# EAGLE design M3-LogicModule (EAGLE 7.6.0)
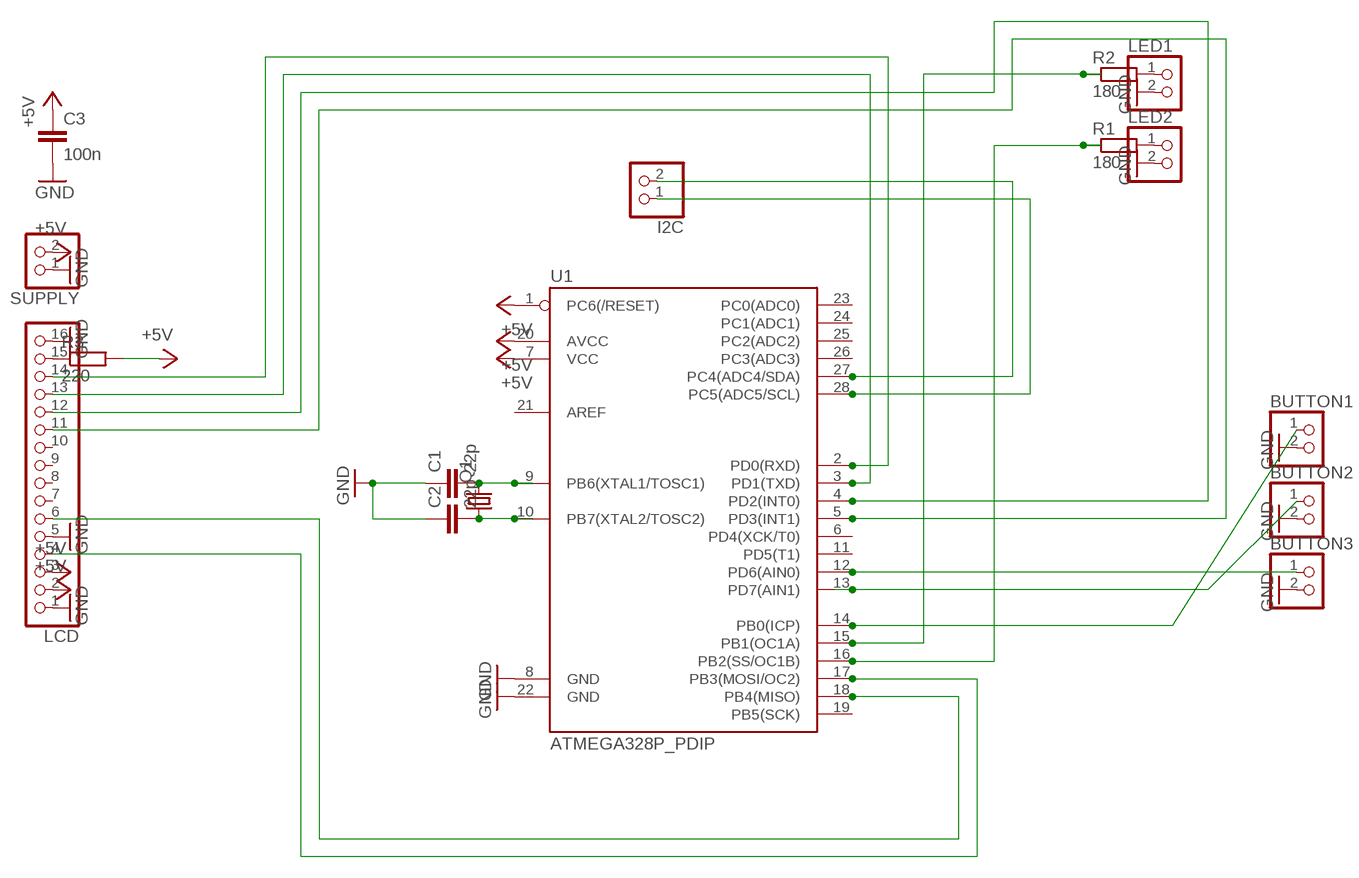
[diagram p0: schematic, sheet 1]

## Parts
BUTTON1  PINHD-1X2  [1X02]
BUTTON2  PINHD-1X2  [1X02]
BUTTON3  PINHD-1X2  [1X02]
C1  22p  C-EU025-025X050  [C025-025X050]
C2  22p  C-EU025-025X050  [C025-025X050]
C3  100n  C2,5-3  [C2.5-3]
I2C  PINHD-1X2  [1X02]
LCD  PINHD-1X16  [1X16]
LED1  PINHD-1X2  [1X02]
LED2  PINHD-1X2  [1X02]
Q1  CRYSTALHC49S  [HC49/S]
R1  180  R-EU_0309/12  [0309/12]
R2  180  R-EU_0309/12  [0309/12]
R3  220  R-EU_0309/10  [0309/10]
SUPPLY  PINHD-1X2  [1X02]
U1  ATMEGA328P_PDIP  [DIL28-3]

## Nets
+5V: C3.1 LCD.2 LCD.3 R3.2 SUPPLY.2 U1.1(PC6(/RESET)) U1.7(VCC) U1.20(AVCC)
GND: BUTTON1.2 BUTTON2.2 BUTTON3.2 C1.1 C2.1 C3.2 LCD.1 LCD.5 LCD.16 LED1.2 LED2.2 SUPPLY.1 U1.8(GND) U1.22(GND)
N$1: C1.2 Q1.2 U1.9(PB6(XTAL1/TOSC1))
N$2: LED2.1 R1.2
N$3: LED1.1 R2.2
N$4: R2.1 U1.15(PB1(OC1A))
N$5: R1.1 U1.16(PB2(SS/OC1B))
N$6: BUTTON1.1 U1.14(PB0(ICP))
N$7: BUTTON2.1 U1.13(PD7(AIN1))
N$8: BUTTON3.1 U1.12(PD6(AIN0))
N$9: C2.2 Q1.1 U1.10(PB7(XTAL2/TOSC2))
N$10: LCD.15 R3.1
N$11: LCD.14 U1.2(PD0(RXD))
N$12: LCD.13 U1.3(PD1(TXD))
N$13: LCD.12 U1.4(PD2(INT0))
N$14: LCD.11 U1.5(PD3(INT1))
N$15: LCD.4 U1.17(PB3(MOSI/OC2))
N$16: LCD.6 U1.18(PB4(MISO))
N$17: I2C.1 U1.28(PC5(ADC5/SCL))
N$18: I2C.2 U1.27(PC4(ADC4/SDA))
Unconnected: LCD.7 LCD.8 LCD.9 LCD.10 U1.6(PD4(XCK/T0)) U1.11(PD5(T1)) U1.19(PB5(SCK)) U1.21(AREF) U1.23(PC0(ADC0)) U1.24(PC1(ADC1)) U1.25(PC2(ADC2)) U1.26(PC3(ADC3))

## Library data of the parts
BUTTON1-BUTTON3 I2C LED1 LED2 SUPPLY = pinhead:PINHD-1X2: PIN HEADER
C1 C2 = rcl:C-EU: CAPACITOR, European symbol
C3 = capacitor-wima:C: CAPACITOR naming: grid - package width
LCD = pinhead:PINHD-1X16: PIN HEADER
Q1 = crystal:CRYSTAL: CRYSTAL; OC_FARNELL: 1667008; OC_NEWARK: unknown
R1 R2 = resistor:R-EU_: RESISTOR, European symbol
R3 = rcl:R-EU_: RESISTOR, European symbol
U1 = SparkFun-DigitalIC:ATMEGA328P_PDIP: uC used in the Arduino 32kb flash, 1k EEPROM, 2k SRAM This is the through-hole version of this chip.

## Board
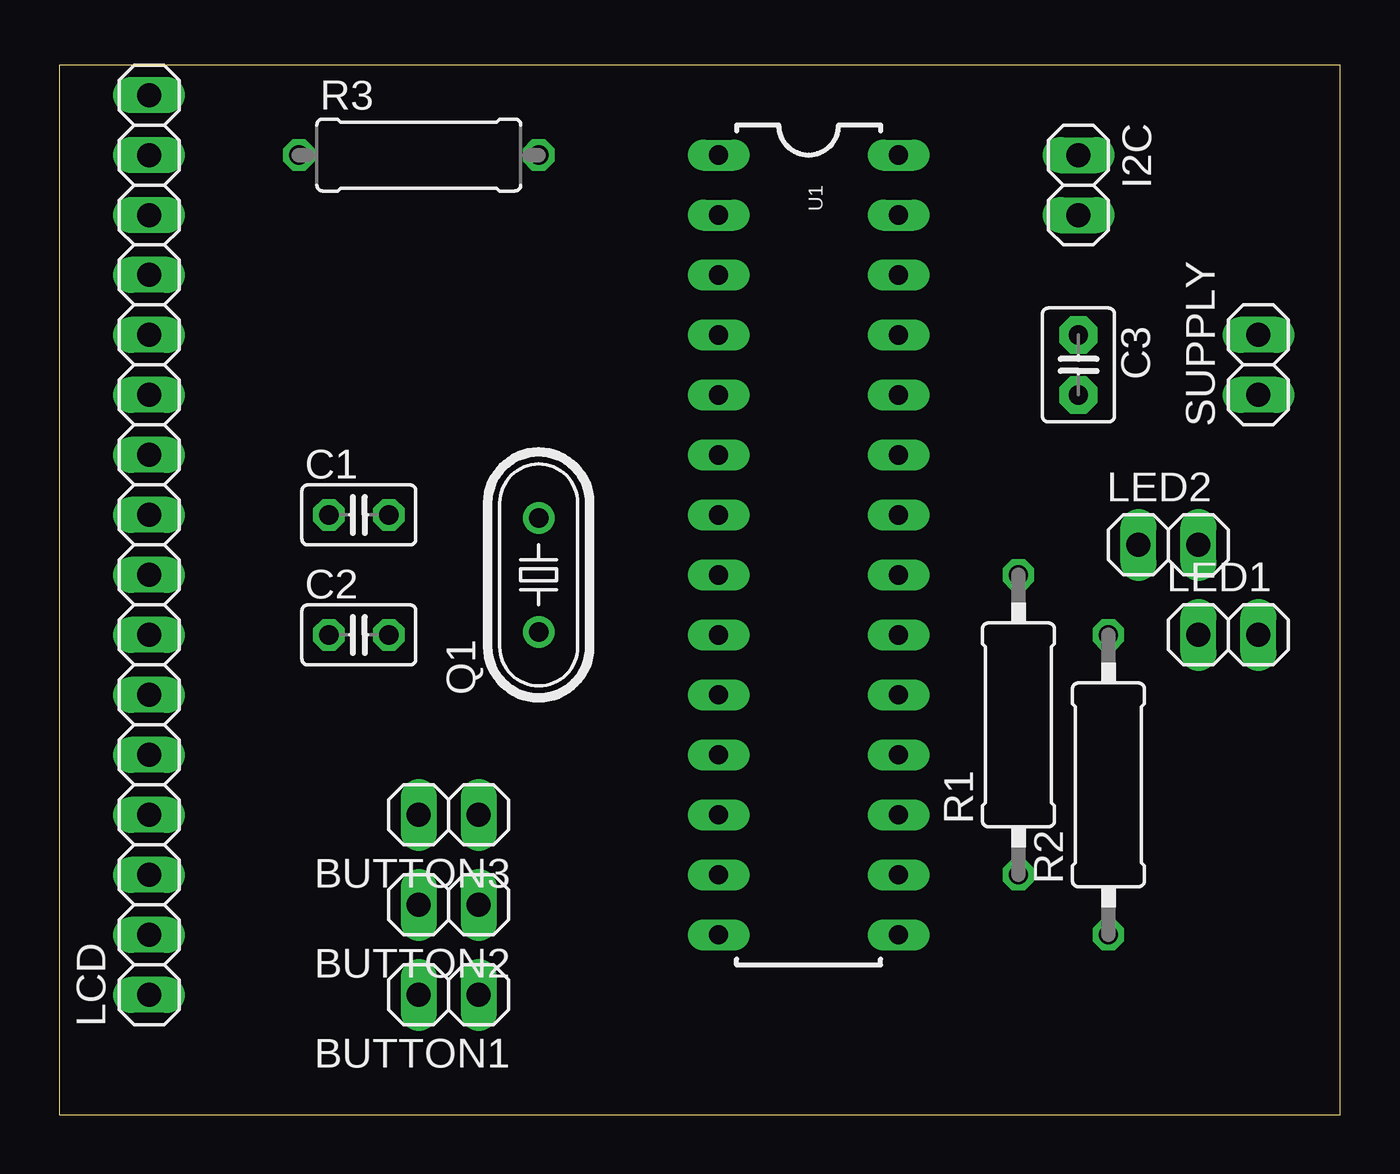
[diagram p1: board, top side]
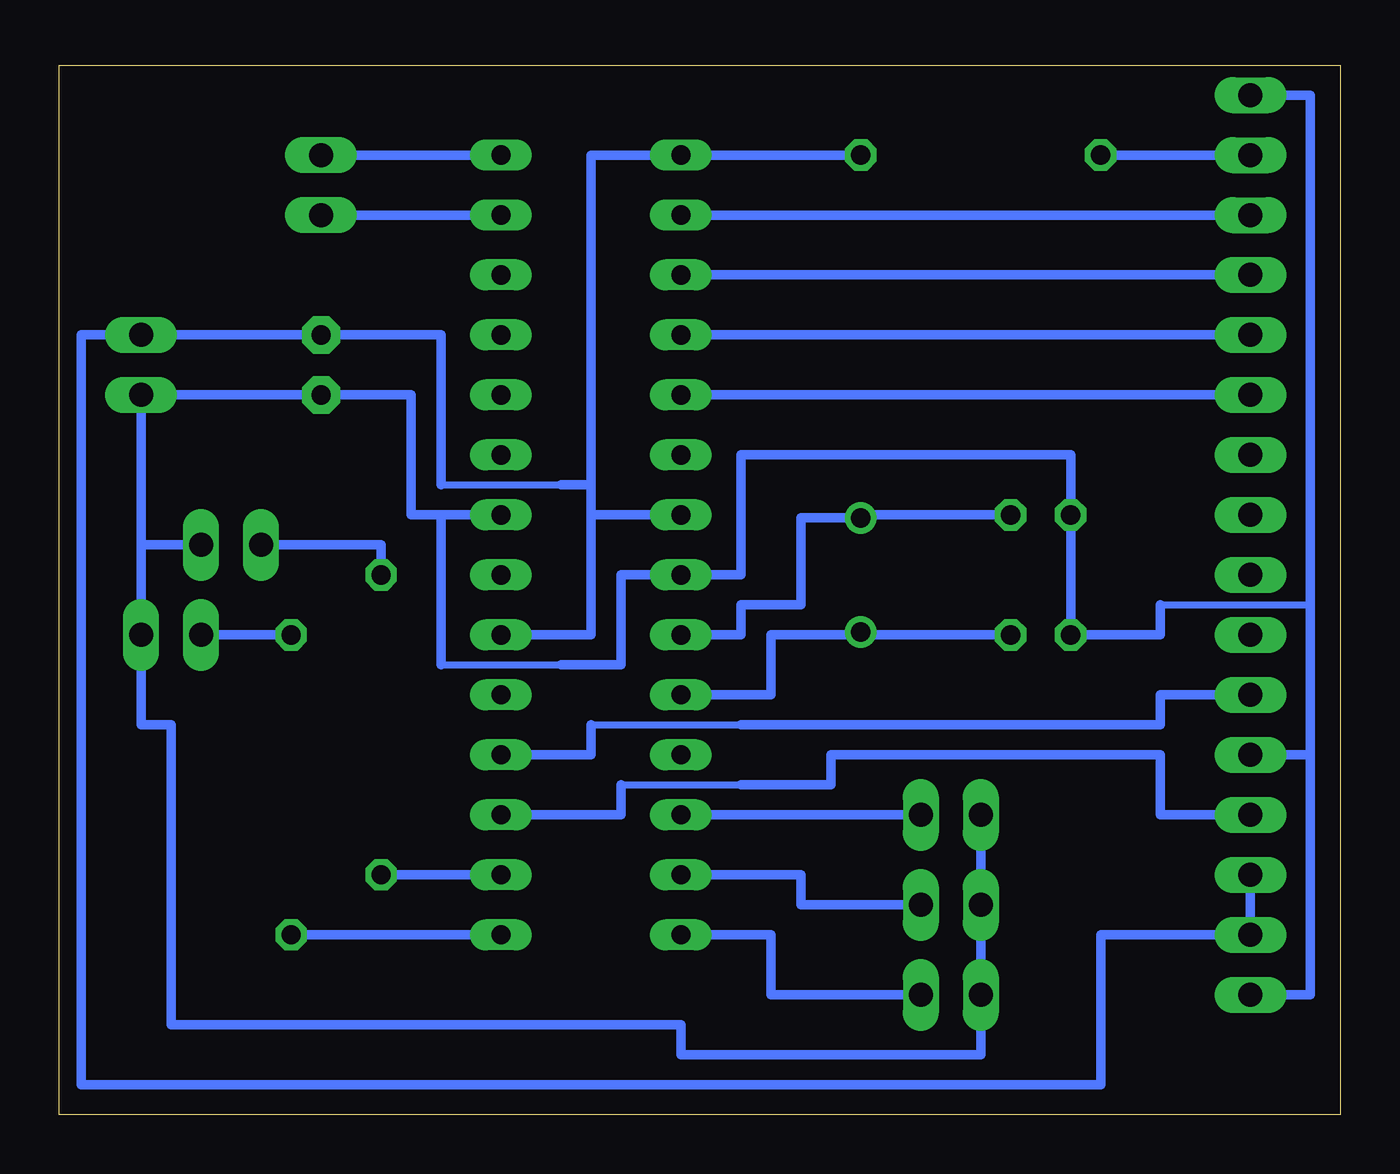
[diagram p2: board, bottom side, seen from below]

Size 54.28 x 44.44 mm. Coordinates in mm from the lower left corner, seen from the top.
Outline: 0,0 54.28,0 54.28,44.44 0,44.44 0,0
Copper layers (1*16): Top 0.035mm / dielectric 1.5mm / Bottom 0.035mm
Design rules "default": minimum track width 10mil, minimum drill 24mil, track to track 8mil, track to pad 8mil, pad to pad 8mil, via to via 8mil, smd to smd 8mil, copper to edge 40mil, drill to drill 8mil, minimum pad ring 10mil, minimum via ring 8mil, stop-mask expansion 4mil, vias tented up to drill 0mil, thermal gap 10mil

### Footprints (pad centres in the part's own frame; a part is rotated, then mirrored left to right if it is on the bottom)
1X02 = drill 1.016 long: 1 -1.27,0; 2 1.27,0
C025-025X050 = drill 0.813 octagon: 1 -1.27,0; 2 1.27,0
C2.5-3 = drill 0.813 pad 1.6 octagon: 1 -1.27,0; 2 1.27,0
1X16 = drill 1.016 long: 1 -19.05,0; 2 -16.51,0; 3 -13.97,0; 4 -11.43,0; 5 -8.89,0; 6 -6.35,0; 7 -3.81,0; 8 -1.27,0; 9 1.27,0; 10 3.81,0; 11 6.35,0; 12 8.89,0; 13 11.43,0; 14 13.97,0; 15 16.51,0; 16 19.05,0
HC49/S = drill 0.813: 1 -2.413,0; 2 2.413,0
0309/12 = drill 0.813 octagon: 1 -6.35,0; 2 6.35,0
0309/10 = drill 0.813 octagon: 1 -5.08,0; 2 5.08,0
DIL28-3 = drill 0.813 long: 1 -16.51,-3.81; 2 -13.97,-3.81; 3 -11.43,-3.81; 4 -8.89,-3.81; 5 -6.35,-3.81; 6 -3.81,-3.81; 7 -1.27,-3.81; 8 1.27,-3.81; 9 3.81,-3.81; 10 6.35,-3.81; 11 8.89,-3.81; 12 11.43,-3.81; 13 13.97,-3.81; 14 16.51,-3.81; 15 16.51,3.81; 16 13.97,3.81; 17 11.43,3.81; 18 8.89,3.81; 19 6.35,3.81; 20 3.81,3.81; 21 1.27,3.81; 22 -1.27,3.81; 23 -3.81,3.81; 24 -6.35,3.81; 25 -8.89,3.81; 26 -11.43,3.81; 27 -13.97,3.81; 28 -16.51,3.81

### Placement (x,y rotation side)
BUTTON1  16.51,5.08 180 top
BUTTON2  16.51,8.89 180 top
BUTTON3  16.51,12.7 180 top
C1  12.7,25.4 0 top
C2  12.7,20.32 0 top
C3  43.18,31.75 270 top
I2C  43.18,39.37 270 top
LCD  3.81,24.13 90 top
LED1  49.53,20.32 0 top
LED2  46.99,24.13 0 top
Q1  20.32,22.86 90 top
R1  40.64,16.51 90 top
R2  44.45,13.97 90 top
R3  15.24,40.64 0 top
SUPPLY  50.8,31.75 90 top
U1  31.75,24.13 270 top

### Tracks (layer width: path | path; a pad name or v marks a point on that pad's centre or on a via)
+5V
  Bottom 0.305: 38.1,26.67 33.02,26.67
  Bottom 0.406: U1.7 31.75,25.4 | 31.75,25.4 31.75,20.32 U1.20 | R3.2 U1.1 31.75,40.64 31.75,26.67 | LCD.3 LCD.2 10.16,7.62 10.16,1.27 53.34,1.27 53.34,33.02 SUPPLY.2 C3.1 38.1,33.02 38.1,26.67 | 31.75,25.4 31.75,26.67 | 31.75,26.67 33.02,26.67
GND
  Bottom 0.305: 7.62,21.59 1.27,21.59 | 38.1,19.05 33.02,19.05
  Bottom 0.406: C1.1 C2.1 | LED2.2 50.8,24.13 | 50.8,24.13 LED1.2 50.8,16.51 49.53,16.51 49.53,3.81 27.94,3.81 27.94,2.54 15.24,2.54 BUTTON1.2 | BUTTON1.2 BUTTON2.2 BUTTON3.2 BUTTON1.2 | 50.8,24.13 SUPPLY.1 C3.2 39.37,30.48 39.37,25.4 U1.22 38.1,25.4 38.1,19.05 | 1.27,15.24 1.27,5.08 LCD.1 | LCD.16 1.27,43.18 1.27,21.59 1.27,15.24 | C2.1 7.62,20.32 7.62,21.59 | 1.27,15.24 LCD.5 | 33.02,19.05 30.48,19.05 30.48,22.86 U1.8 25.4,22.86 25.4,27.94 11.43,27.94 C2.1
N$1
  Bottom 0.406: C1.2 20.32,25.4 Q1.2 22.86,25.27 22.86,21.59 25.4,21.59 25.4,20.32 U1.9
N$2
  Bottom 0.406: R1.2 40.64,24.13 LED2.1
N$3
  Bottom 0.406: R2.2 LED1.1
N$4
  Bottom 0.406: U1.15 R2.1
N$5
  Bottom 0.406: U1.16 R1.1
N$6
  Bottom 0.406: U1.14 24.13,7.62 24.13,5.08 BUTTON1.1
N$7
  Bottom 0.406: U1.13 22.86,10.16 22.86,8.89 BUTTON2.1
N$8
  Bottom 0.406: BUTTON3.1 U1.12
N$9
  Bottom 0.406: C2.2 20.32,20.32 | U1.10 24.13,17.78 24.13,20.32 20.32,20.32 | 20.32,20.32 Q1.1
N$10
  Bottom 0.406: R3.1 LCD.15
N$11
  Bottom 0.406: LCD.14 U1.2
N$12
  Bottom 0.406: LCD.13 U1.3
N$13
  Bottom 0.406: LCD.12 U1.4
N$14
  Bottom 0.406: LCD.11 U1.5
N$15
  Bottom 0.305: 30.48,13.97 25.4,13.97
  Bottom 0.406: U1.17 30.48,12.7 30.48,13.97 | LCD.4 7.62,12.7 7.62,15.24 21.59,15.24 21.59,13.97 25.4,13.97
N$16
  Bottom 0.305: 31.75,16.51 25.4,16.51
  Bottom 0.406: LCD.6 7.62,17.78 7.62,16.51 25.4,16.51 | 31.75,16.51 31.75,15.24 U1.18
N$17
  Bottom 0.406: U1.28 I2C.1
N$18
  Bottom 0.406: U1.27 I2C.2